# Altium schematic sheet DAC_PART.SchDoc
size A4
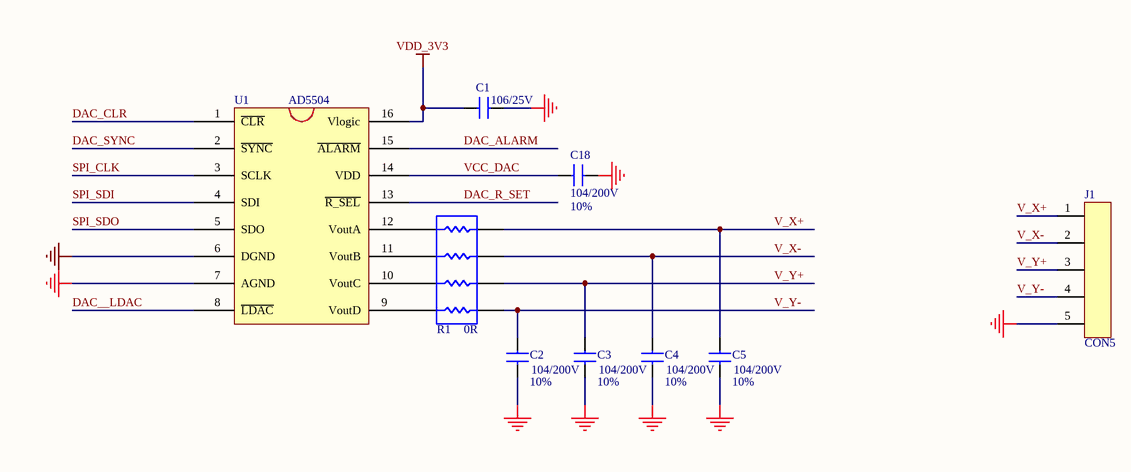
[diagram p0: DAC_PART.SchDoc]

## Parts
C1  106/25V  [0603C/1]
C2  104/200V  [0805C]
C3  104/200V  [0805C]
C4  104/200V  [0805C]
C5  104/200V  [0805C]
C18  104/200V  [0805C]
J1  CON5  [DUT_1XN_1.2_2.0]
R1  0R  [4R0603/1]
U1  AD5504  [TSSOP-16_L5.0-W4.4-P0.65-LS6.4-BL]

## Nets
GND: C1.1 C2.1 C3.1 C4.1 C5.1 C18.1 J1.5 U1.6(DGND) U1.7(AGND)
VDD_3V3: C1.2 U1.16(Vlogic)
DAC__LDAC: U1.8(~{LDAC})
DAC_ALARM: U1.15(~{ALARM})
DAC_CLR: U1.1(~{CLR})
DAC_R_SET: U1.13(~{R_SEL})
DAC_SYNC: U1.2(~{SYNC})
SPI_CLK: U1.3(SCLK)
SPI_SDI: U1.4(SDI)
SPI_SDO: U1.5(SDO)
V_X+: C5.2 J1.1 R1.2
V_X-: C4.2 J1.2 R1.4
V_Y+: C3.2 J1.3 R1.6
V_Y-: C2.2 J1.4 R1.8
VCC_DAC: C18.2 U1.14(VDD)
NetR1_1: R1.1 U1.12(VoutA)
NetR1_3: R1.3 U1.11(VoutB)
NetR1_5: R1.5 U1.10(VoutC)
NetR1_7: R1.7 U1.9(VoutD)

## Notes on the sheet
- (in symbol 电容) 10%

## Library data of the parts
C1-C5 C18 = 电容: Capacitor
J1 = CON5: SOCKET
R1 = RES4/1